# EAGLE design Shield Programmer (EAGLE 7.2.0)
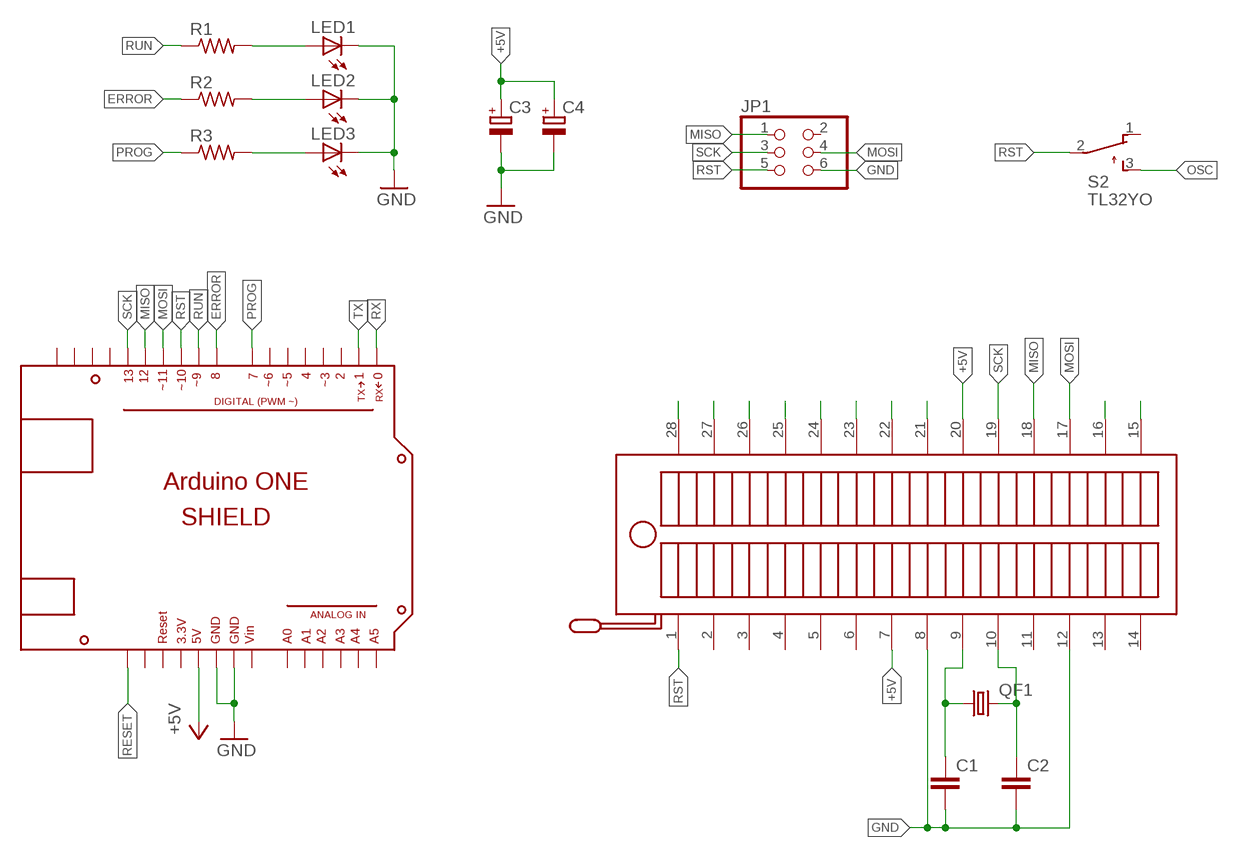
[diagram p0: schematic, sheet 1]

## Parts
C1  C5/2.5  [C5B2.5]
C2  C5/2.5  [C5B2.5]
C3  CPOL-EUE2.5-7  [E2,5-7]
C4  CPOL-EUE2.5-7  [E2,5-7]
JP1  PINHD-2X3  [2X03]
LED1  LED3MM  [LED3MM]
LED2  LED3MM  [LED3MM]
LED3  LED3MM  [LED3MM]
QF1  CRYSTALHC49U-V  [HC49U-V]
R1  R-US_0204/7  [0204/7]
R2  R-US_0204/7  [0204/7]
R3  R-US_0204/7  [0204/7]
S2  TL32YO  [TL3XYO]
U$2  ZIF-28  [ZIF-28]
U$3  SHIELD  [SHIELD]

## Nets
+5V: C3.+ C4.+ U$2.7(PIN7) U$2.20(PIN20) U$3.5V
ERROR: R2.1 U$3.8
GND: C1.2 C2.2 C3.- C4.- JP1.6 LED1.K(C) LED2.K(C) LED3.K(C) U$2.8(PIN8) U$2.12(PIN12) U$3.GND1 U$3.GND2
MISO: JP1.1 U$2.18(PIN18) U$3.12
MOSI: JP1.4 U$2.17(PIN17) U$3.11
N$3: LED3.A R3.2
N$4: LED2.A R2.2
N$5: LED1.A R1.2
N$10: C2.1 QF1.2 U$2.10(PIN10)
N$13: U$2.15(PIN15)
N$14: U$2.16(PIN16)
N$15: U$2.21(PIN21)
N$16: U$2.22(PIN22)
N$17: U$2.23(PIN23)
N$18: U$2.24(PIN24)
N$19: U$2.25(PIN25)
N$20: U$2.26(PIN26)
N$21: U$2.27(PIN27)
N$22: U$2.28(PIN28)
OSC: C1.1 QF1.1 S2.3(S) U$2.9(PIN9)
PROG: R3.1 U$3.7
RESET: U$3.NONE
RST: JP1.5 S2.2(P) U$2.1(PIN1) U$3.10
RUN: R1.1 U$3.9
RX: U$3.0
SCK: JP1.3 U$2.19(PIN19) U$3.13
TX: U$3.1
Unconnected: JP1.2 S2.1(O) U$2.2(PIN2) U$2.3(PIN3) U$2.4(PIN4) U$2.5(PIN5) U$2.6(PIN6) U$2.11(PIN11) U$2.13(PIN13) U$2.14(PIN14) U$3.2 U$3.3 U$3.3.3V U$3.4 U$3.5 U$3.6 U$3.14 U$3.15 U$3.16 U$3.17 U$3.A0 U$3.A1 U$3.A2 U$3.A3 U$3.A4 U$3.A5 U$3.IOREF U$3.RST U$3.VIN

## Library data of the parts
C1 C2 = capacitor-wima:C: CAPACITOR naming: grid - package width
C3 C4 = resistor:CPOL-EU: POLARIZED CAPACITOR, European symbol
JP1 = pinhead:PINHD-2X3: PIN HEADER
LED1-LED3 = led:LED: LED OSRAM: - CHIPLED LG R971, LG N971, LY N971, LG Q971, LY Q971, LO R971, LY R971 LH N974, LH R974 LS Q976, LO Q976, LY Q976 LO Q996 - Hyper CHIPLED LW Q18S LB Q993, LB Q99A, LB R99A - SideLED LS A670, LO A670, LY A670, LG A670, LP A670 LB A673, LV A673, LT A673, LW A673 LH A674 LY A675 LS A676, LA A676, LO A676, LY A676, LW A676 LS A679, LY A679, LG A679 - Hyper Micro SIDELED® LS Y876, LA Y876, LO Y876, LY Y876 LT Y87S - SmartLED LW L88C, LW L88S LB L89C, LB L89S, LG L890 LS L89K, LO L89K, LY L89K LS L896, LA L896, LO L896, LY L896 - TOPLED LS T670, LO T670, LY T670, LG T670, LP T670 LSG T670, LSP T670, LSY T670, LOP T670, LYG T670 LG T671, LOG T671, LSG T671 LB T673, LV T673, LT T673, LW T673 LH T674 LS T676, LA T676, LO T676, LY T676, LB T676, LH T676, LSB T676, LW T676 LB T67C, LV T67C, LT T67C, LS T67K, LO T67K, LY T67K, LW E67C LS E67B, LA E67B, LO E67B, LY E67B, LB E67C, LV E67C, LT E67C LW T67C LS T679, LY T679, LG T679 LS T770, LO T770, LY T770, LG T770, LP T770 LB T773, LV T773, LT T773, LW T773 LH T774 LS E675, LA E675, LY E675, LS T675 LS T776, LA T776, LO T776, LY T776, LB T776 LHGB T686 LT T68C, LB T68C - Hyper Mini TOPLED® LB M676 - Mini TOPLED Santana® LG M470 LS M47K, LO M47K, LY M47K Source: http://www.osram.convergy.de LUXEON: - LUMILED® LXK2-PW12-R00, LXK2-PW12-S00, LXK2-PW14-U00, LXK2-PW14-V00 LXK2-PM12-R00, LXK2-PM12-S00, LXK2-PM14-U00 LXK2-PE12-Q00, LXK2-PE12-R00, LXK2-PE12-S00, LXK2-PE14-T00, LXK2-PE14-U00 LXK2-PB12-K00, LXK2-PB12-L00, LXK2-PB12-M00, LXK2-PB14-N00, LXK2-PB14-P00, LXK2-PB14-Q00 LXK2-PR12-L00, LXK2-PR12-M00, LXK2-PR14-Q00, LXK2-PR14-R00 LXK2-PD12-Q00, LXK2-PD12-R00, LXK2-PD12-S00 LXK2-PH12-R00, LXK2-PH12-S00 LXK2-PL12-P00, LXK2-PL12-Q00, LXK2-PL12-R00 Source: www.luxeon.com KINGBRIGHT: KA-3528ASYC Source: www.kingbright.com
QF1 = crystal:CRYSTAL: CRYSTAL; OC_FARNELL: 1666969; OC_NEWARK: unknown
R1-R3 = resistor:R-US_: RESISTOR, American symbol
S2 = switch:TL32YO: TINY SWITCH ON - MOM Source: http://www2.produktinfo.conrad.com/datenblaetter/700000-724999/705152-da-01-de-Subminiaturschalter_TL_36YO.pdf
U$2 = E-Lab:ZIF-28: Base ZIF-28 Base para colocar circuitos integrados de 28 pines para remover facilmente sin dañarlos.
U$3 = E-Lab:SHIELD

## Board
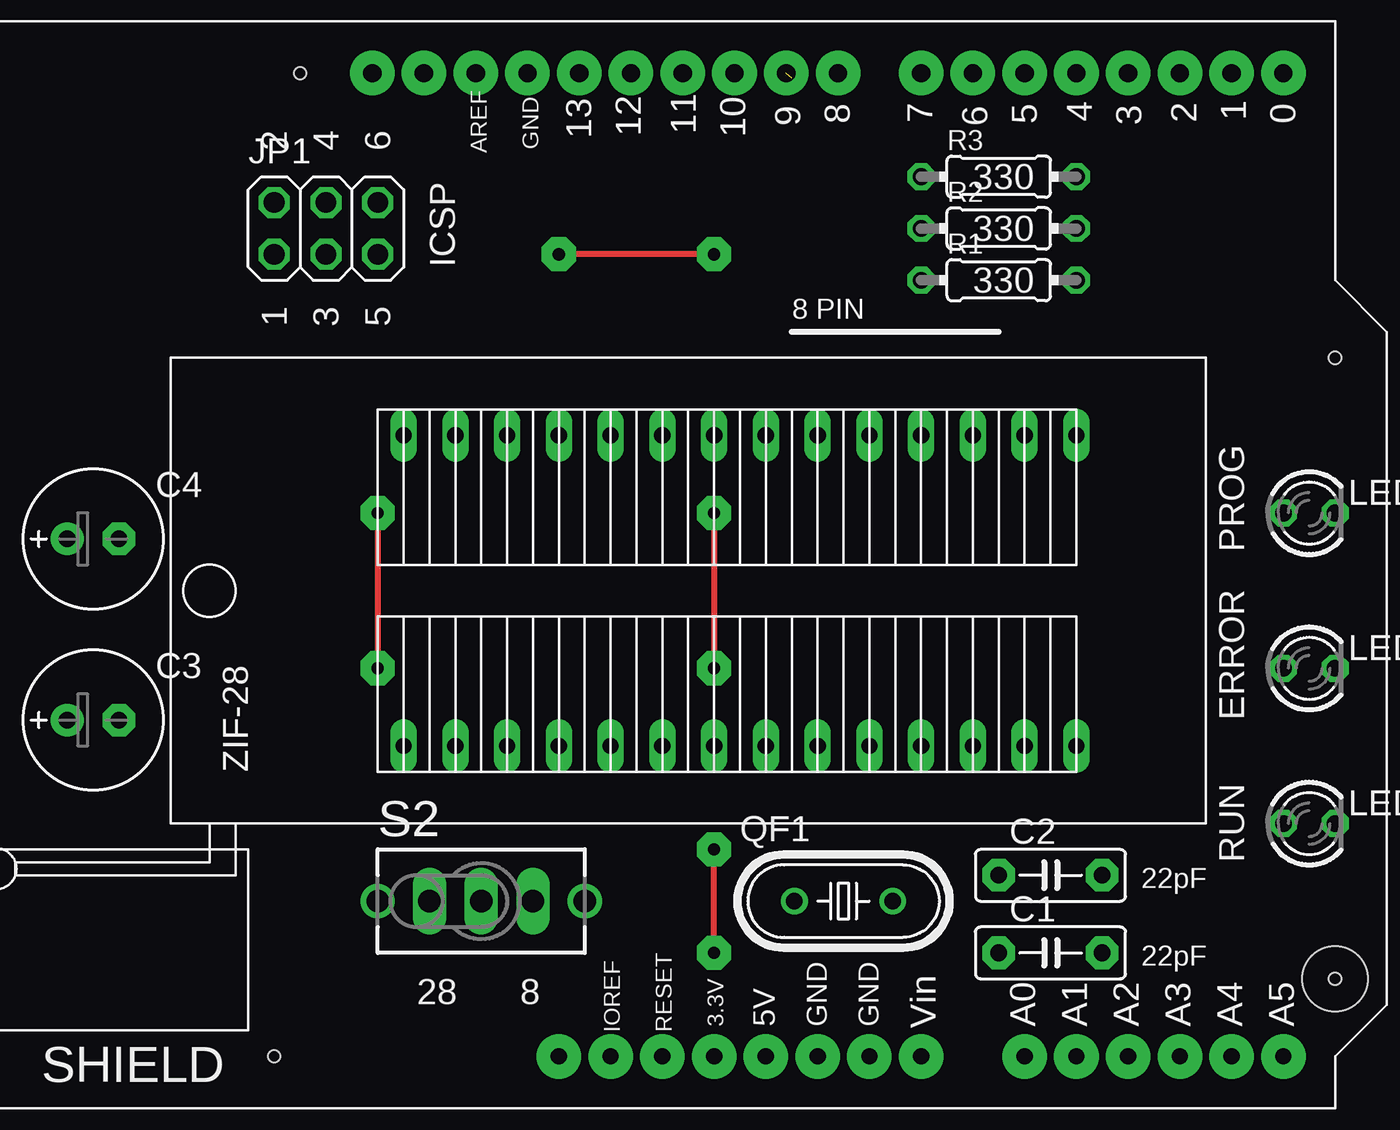
[diagram p1: board, top side]
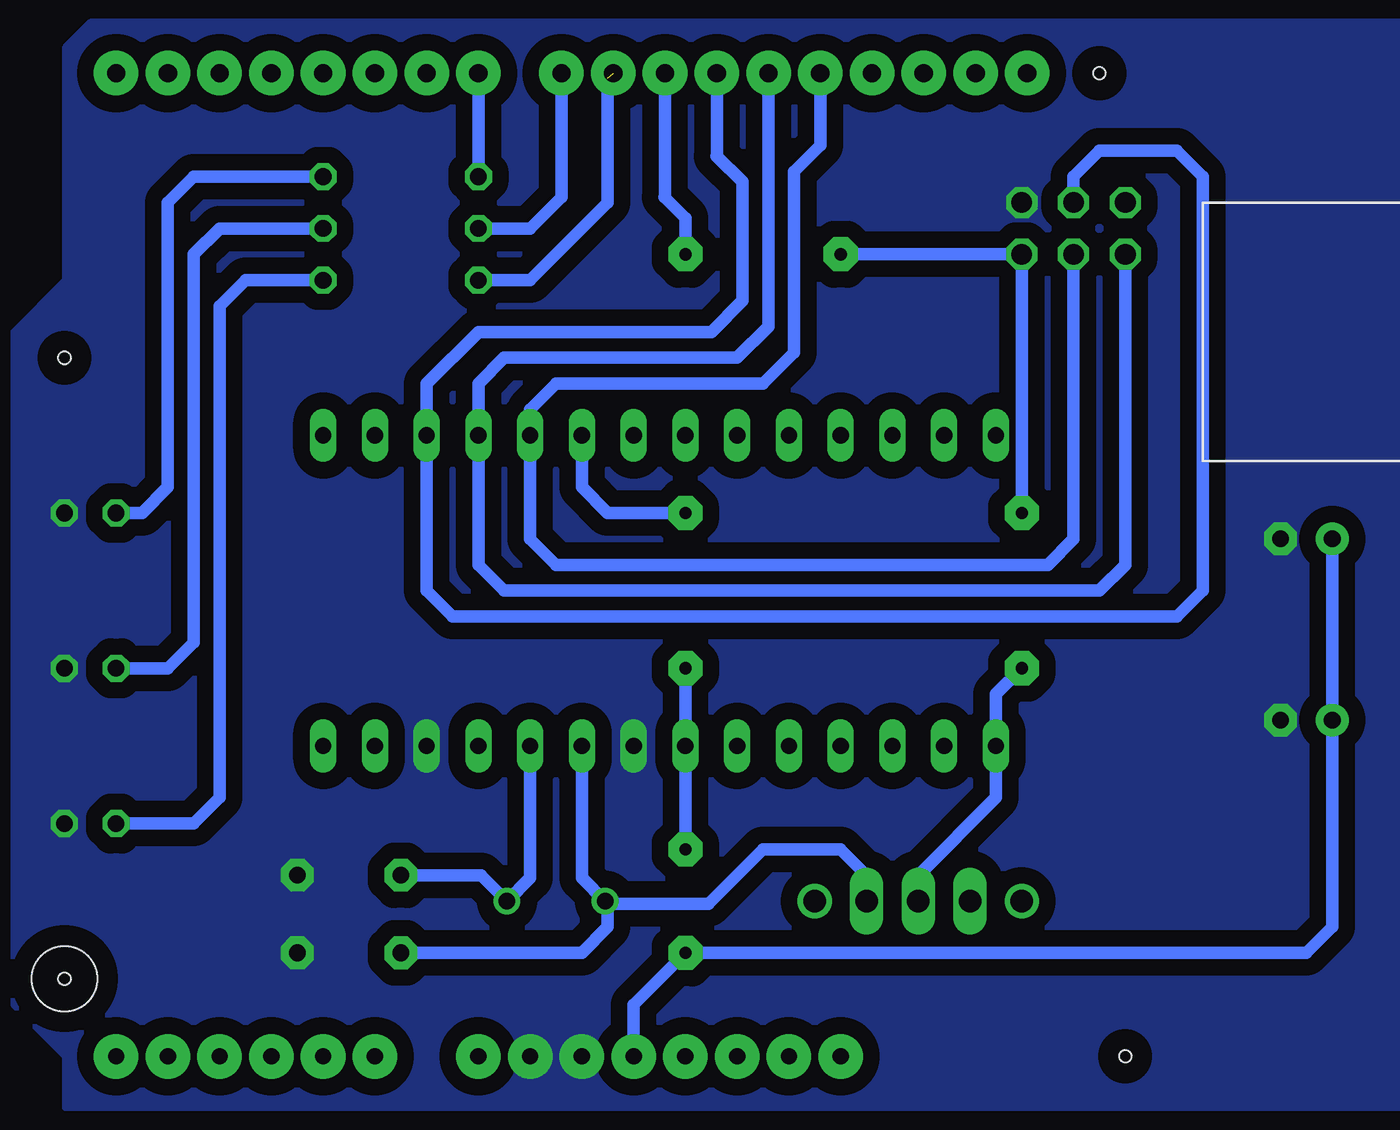
[diagram p2: board, bottom side, seen from below]

No outline drawn. Coordinates in mm, seen from the top.
Copper layers (1*16): Top 0.035mm / dielectric 1.5mm / Bottom 0.035mm
Design rules "default": minimum track width 10mil, minimum drill 24mil, track to track 8mil, track to pad 8mil, pad to pad 8mil, via to via 8mil, smd to smd 8mil, copper to edge 40mil, drill to drill 8mil, minimum pad ring 10mil, minimum via ring 8mil, stop-mask expansion 4mil, vias tented up to drill 0mil, thermal gap 10mil
Holes 3.2 mm at 66.04,6.35

### Footprints (pad centres in the part's own frame; a part is rotated, then mirrored left to right if it is on the bottom)
C5B2.5 = drill 0.813 pad 1.6 octagon: 1 -2.54,0; 2 2.54,0
E2,5-7 = drill 0.813 pad 1.6: + -1.27,0 | drill 0.813 pad 1.6 octagon: - 1.27,0
2X03 = drill 1.016 octagon: 1 -2.54,-1.27; 2 -2.54,1.27; 3 0,-1.27; 4 0,1.27; 5 2.54,-1.27; 6 2.54,1.27
LED3MM = drill 0.813 octagon: A -1.27,0; K 1.27,0
HC49U-V = drill 0.813: 1 -2.413,0; 2 2.413,0
0204/7 = drill 0.813 octagon: 1 -3.81,0; 2 3.81,0
TL3XYO = drill 1.1 pad 1.422 long: 1 -2.54,0; 2 0,0; 3 2.54,0 | drill 1.1 pad 1.676: M1 -5.08,0; M2 5.08,0
ZIF-28 = drill 0.8 long: 1 -15.24,-7.62; 2 -12.7,-7.62; 3 -10.16,-7.62; 4 -7.62,-7.62; 5 -5.08,-7.62; 6 -2.54,-7.62; 7 0,-7.62; 8 2.54,-7.62; 9 5.08,-7.62; 10 7.62,-7.62; 11 10.16,-7.62; 12 12.7,-7.62; 13 15.24,-7.62; 14 17.78,-7.62; 15 17.78,7.62; 16 15.24,7.62; 17 12.7,7.62; 18 10.16,7.62; 19 7.62,7.62; 20 5.08,7.62; 21 2.54,7.62; 22 0,7.62; 23 -2.54,7.62; 24 -5.08,7.62; 25 -7.62,7.62; 26 -10.16,7.62; 27 -12.7,7.62; 28 -15.24,7.62
SHIELD = drill 0.9 pad 2.184: 0 27.94,22.86; 1 25.4,22.86; 2 22.86,22.86; 3 20.32,22.86; 4 17.78,22.86; 5 15.24,22.86; 6 12.7,22.86; 7 10.16,22.86; 8 6.079,22.86; 9 3.539,22.86; 10 1,22.86; 11 -1.54,22.86; 12 -4.08,22.86; 13 -6.62,22.86; 14 -9.16,22.86; 15 -11.7,22.86; 16 -14.24,22.86; 17 -16.78,22.86 | drill 0.8 pad 2.184: 3.3V 0,-25.4; 5V 2.54,-25.4; A0 15.24,-25.4; A1 17.78,-25.4; A2 20.32,-25.4; A3 22.86,-25.4; A4 25.4,-25.4; A5 27.94,-25.4; GND1 7.62,-25.4; GND2 5.08,-25.4; IOREF -5.08,-25.4; NONE -7.62,-25.4; RST -2.54,-25.4; VIN 10.16,-25.4 | hole 0.6: 30.48,-21.59; 30.48,8.89; -20.32,22.86; -21.59,-25.4

### Placement (x,y rotation side)
C1  52.07,7.62 0 top
C2  52.07,11.43 0 top
C3  5.08,19.05 0 top
C4  5.08,27.94 0 top
JP1  16.51,43.18 0 top
LED1  64.77,13.97 0 top
LED2  64.77,21.59 0 top
LED3  64.77,29.21 0 top
QF1  41.91,10.16 0 top
R1  49.53,40.64 0 top
R2  49.53,43.18 0 top
R3  49.53,45.72 0 top
S2  24.13,10.16 0 top
U$2  35.56,25.4 0 top
U$3  35.56,27.94 0 top

### Tracks (layer width: path | path; a pad name or v marks a point on that pad's centre or on a via)
+5V  (via drill 0.6 pad 1.68)
  Top 0.305: v35.56,29.21 v35.56,21.59 | v35.56,7.62 v35.56,12.7
  Bottom 0.61: U$2.20 40.64,30.48 39.37,29.21 v35.56,29.21 | v35.56,21.59 U$2.7 v35.56,12.7 | C4.+ C3.+ 3.81,8.89 5.08,7.62 v35.56,7.62 38.1,5.08 U$3.5V
ERROR
  Bottom 0.61: R2.1 43.18,43.18 41.64,44.72 U$3.8
GND
  pour Bottom (isolate 0.813, no thermals): 0,0 0,53.34 64.77,53.34 66.04,52.07 66.04,40.64 68.58,38.1 68.58,5.08 66.04,2.54 66.04,0
MISO
  Bottom 0.61: JP1.1 13.97,26.67 15.24,25.4 44.45,25.4 45.72,26.67 U$2.18 45.72,35.56 44.45,36.83 33.02,36.83 31.48,38.37 U$3.12
MOSI
  Bottom 0.61: JP1.4 16.51,45.72 15.24,46.99 11.43,46.99 10.16,45.72 10.16,25.4 11.43,24.13 46.99,24.13 48.26,25.4 U$2.17 48.26,35.56 45.72,38.1 34.29,38.1 32.77,39.62 32.77,45.47 34.04,46.74 34.02,46.75 U$3.11
N$3
  Bottom 0.61: LED3.A 62.23,29.21 60.96,30.48 60.96,44.45 59.69,45.72 R3.2
N$4
  Bottom 0.61: R2.2 58.42,43.18 59.69,41.91 59.69,22.86 60.96,21.59 LED2.A
N$5
  Bottom 0.61: R1.2 57.15,40.64 58.42,39.37 58.42,15.24 59.69,13.97 LED1.A
N$10
  Bottom 0.61: U$2.10 43.18,11.3 QF1.2 45.59,11.43 C2.1
OSC
  Bottom 0.61: U$2.9 40.64,11.3 QF1.1 39.37,10.03 | C1.1 40.64,7.62 39.37,8.89 39.37,10.03 | 39.37,10.03 34.42,10.03 31.75,12.7 27.94,12.7 26.67,11.43 S2.3
PROG
  Bottom 0.61: U$3.7 R3.1
RST  (via drill 0.6 pad 1.68)
  Top 0.305: v35.56,41.91 v27.94,41.91 | v19.05,29.21 v19.05,21.59
  Bottom 0.61: v35.56,41.91 35.56,43.69 36.58,44.7 36.56,44.72 U$3.10 | v27.94,41.91 JP1.5 v19.05,29.21 | v19.05,21.59 20.32,20.32 U$2.1 20.32,15.24 24.13,11.43 S2.2
RUN  (1 unrouted)
  Bottom 0.61: R1.1 43.18,40.64 39.37,44.45 39.37,50.55
SCK
  Bottom 0.61: JP1.3 16.51,27.94 17.78,26.67 41.91,26.67 43.18,27.94 U$2.19 43.18,34.29 41.91,35.56 31.75,35.56 30.23,37.08 30.23,45.97 28.94,47.26 U$3.13

### Text on the board
tPlace: 2 | 4 | 6 | 330 | 330 | ICSP | 330 | 1 | 3 | 5 | 8 PIN | PROG | ERROR | RUN | 22pF | 22pF | 28 | 8
Etiquetas: PROGRAMMER | SHIELD